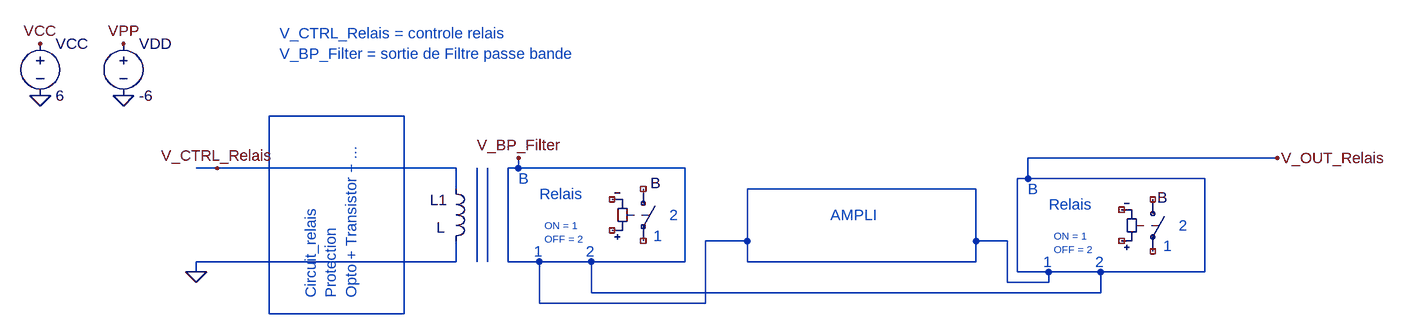
[diagram p0: schematic Selection_voie.asc]
Selection_voie.asc, the LTspice schematic file:
Version 4
SHEET 1 3580 680
WIRE 1136 48 928 48
WIRE 2480 112 2096 112
WIRE 848 128 816 128
WIRE 1216 128 848 128
WIRE 1312 128 1312 112
WIRE 1312 128 1296 128
WIRE 1568 128 1312 128
WIRE 2096 144 2096 112
WIRE 2096 144 2080 144
WIRE 2368 144 2096 144
WIRE 1216 160 1216 128
WIRE 2016 160 1664 160
WIRE 1664 240 1664 160
WIRE 1664 240 1600 240
WIRE 2016 240 2016 160
WIRE 2064 240 2016 240
WIRE 1216 272 1216 240
WIRE 1216 272 816 272
WIRE 1248 272 1248 128
WIRE 1264 272 1264 128
WIRE 1296 272 1296 128
WIRE 1344 272 1296 272
WIRE 1424 272 1344 272
WIRE 1568 272 1568 128
WIRE 1568 272 1424 272
WIRE 1664 272 1664 240
WIRE 2016 272 2016 240
WIRE 2016 272 1664 272
WIRE 816 288 816 272
WIRE 2080 288 2080 144
WIRE 2128 288 2080 288
WIRE 2208 288 2128 288
WIRE 2368 288 2368 144
WIRE 2368 288 2208 288
WIRE 2064 304 2064 240
WIRE 2128 304 2128 288
WIRE 2128 304 2064 304
WIRE 1424 320 1424 272
WIRE 2208 320 2208 288
WIRE 2208 320 1424 320
WIRE 1344 336 1344 272
WIRE 1600 336 1600 240
WIRE 1600 336 1344 336
WIRE 928 352 928 48
WIRE 1136 352 1136 48
WIRE 1136 352 928 352
FLAG 576 16 0
FLAG 704 16 0
FLAG 576 -64 VCC
FLAG 704 -64 VPP
FLAG 1312 112 V_BP_Filter
FLAG 848 128 V_CTRL_Relais
FLAG 816 288 0
FLAG 2480 112 V_OUT_Relais
SYMBOL voltage 576 -80 R0
WINDOW 123 0 0 Left 0
WINDOW 39 0 0 Left 0
SYMATTR InstName VCC
SYMATTR Value 6
SYMBOL voltage 704 -80 R0
WINDOW 123 0 0 Left 0
WINDOW 39 0 0 Left 0
SYMATTR InstName VDD
SYMATTR Value -6
SYMBOL ind 1200 144 R0
WINDOW 0 -24 33 Left 2
WINDOW 3 -14 75 Left 2
SYMATTR InstName L1
SYMBOL sw 2288 160 R0
WINDOW 0 7 13 Left 2
SYMATTR InstName B
SYMATTR Value ""
SYMBOL sw 1504 144 R0
WINDOW 0 11 7 Left 2
SYMATTR InstName B
SYMATTR Value ""
TEXT 1792 200 Left 2 ;AMPLI
TEXT 1344 168 Left 2 ;Relais
TEXT 1336 256 Left 2 ;1
TEXT 1416 256 Left 2 ;2
TEXT 1352 216 Left 1 ;ON = 1\nOFF = 2
TEXT 2128 184 Left 2 ;Relais
TEXT 2120 272 Left 2 ;1
TEXT 2200 272 Left 2 ;2
TEXT 2136 232 Left 1 ;ON = 1\nOFF = 2
TEXT 2328 216 Left 2 ;2
TEXT 2304 248 Left 2 ;1
TEXT 1544 200 Left 2 ;2
TEXT 1520 232 Left 2 ;1
TEXT 1312 144 Left 2 ;B
TEXT 2096 160 Left 2 ;B
TEXT 944 -80 Left 2 ;V_CTRL_Relais = controle relais\nV_BP_Filter = sortie de Filtre passe bande
TEXT 992 328 VLeft 2 ;Circuit_relais\nProtection\nOpto + Transistor + ...

The netlist it stands for:
* Selection_voie.asc
VCC VCC 0 6
VDD VPP 0 -6
L1 V_CTRL_Relais 0 L
S§B NC_01 NC_02 NC_03 NC_04
S§B NC_05 NC_06 NC_07 NC_08
* AMPLI
* Relais
* 1
* 2
* ON = 1
* OFF = 2
* Relais
* 1
* 2
* ON = 1
* OFF = 2
* 2
* 1
* 2
* 1
* B
* B
* V_CTRL_Relais = controle relais
* V_BP_Filter = sortie de Filtre passe bande
* Circuit_relais
* Protection
* Opto + Transistor + ...
.backanno
.end